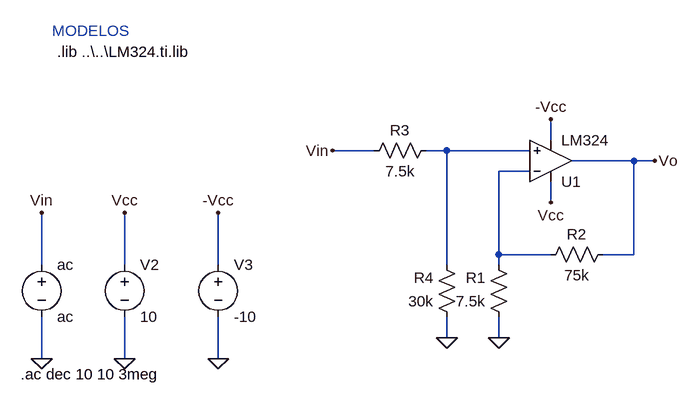
[diagram p0: schematic Modelo-2.asc]
Modelo-2.asc, the LTspice schematic file:
Version 4
SHEET 1 1860 680
WIRE 496 -160 496 -192
WIRE 224 -144 160 -144
WIRE 336 -144 304 -144
WIRE 464 -144 336 -144
WIRE 624 -128 528 -128
WIRE 656 -128 624 -128
WIRE 464 -112 416 -112
WIRE 496 -64 496 -96
WIRE 416 16 416 -112
WIRE 496 16 416 16
WIRE 624 16 624 -128
WIRE 624 16 576 16
WIRE -288 32 -288 -48
WIRE -160 32 -160 -48
WIRE -16 32 -16 -48
WIRE 336 32 336 -144
WIRE 416 32 416 16
WIRE 336 144 336 112
WIRE 416 144 416 112
WIRE -288 176 -288 112
WIRE -160 176 -160 112
WIRE -16 176 -16 112
FLAG 336 144 0
FLAG 416 144 0
FLAG -288 176 0
FLAG -160 176 0
FLAG -16 176 0
FLAG -160 -48 Vcc
FLAG 496 -64 Vcc
FLAG -16 -48 -Vcc
FLAG 496 -192 -Vcc
FLAG -288 -48 Vin
FLAG 160 -144 Vin
FLAG 656 -128 Vo
SYMBOL Opamps\\opamp2 496 -64 M180
SYMATTR InstName U1
SYMATTR Value LM324
SYMBOL voltage -288 16 R0
WINDOW 123 0 0 Left 0
WINDOW 39 0 0 Left 0
SYMATTR InstName ac
SYMATTR Value ac
SYMBOL voltage -160 16 R0
SYMATTR InstName V2
SYMATTR Value 10
SYMBOL voltage -16 16 R0
SYMATTR InstName V3
SYMATTR Value -10
SYMBOL res 320 -160 R90
WINDOW 0 0 56 VBottom 2
WINDOW 3 32 56 VTop 2
SYMATTR InstName R3
SYMATTR Value 7.5k
SYMBOL res 352 128 R180
WINDOW 0 36 76 Left 2
WINDOW 3 36 40 Left 2
SYMATTR InstName R4
SYMATTR Value 30k
SYMBOL res 432 128 R180
WINDOW 0 36 76 Left 2
WINDOW 3 36 40 Left 2
SYMATTR InstName R1
SYMATTR Value 7.5k
SYMBOL res 480 32 R270
WINDOW 0 32 56 VTop 2
WINDOW 3 0 56 VBottom 2
SYMATTR InstName R2
SYMATTR Value 75k
TEXT -264 -296 Left 2 !.lib ..\\..\\LM324.ti.lib
TEXT -272 -328 Left 2 ;MODELOS
TEXT -320 200 Left 2 !.ac dec 10 10 3meg

The netlist it stands for:
* Modelo-2.asc
XU1 N001 N002 Vcc -Vcc Vo LM324  ; pins In+ In- V+ V- OUT
V§ac Vin 0 ac
V2 Vcc 0 10
V3 -Vcc 0 -10
R3 N001 Vin 7.5k
R4 0 N001 30k
R1 0 N002 7.5k
R2 N002 Vo 75k
.lib ..\..\LM324.ti.lib
* MODELOS
.ac dec 10 10 3meg
.backanno
.end